# EAGLE design Bias_Lighting_Controller_Schematic (EAGLE 9.2.2)
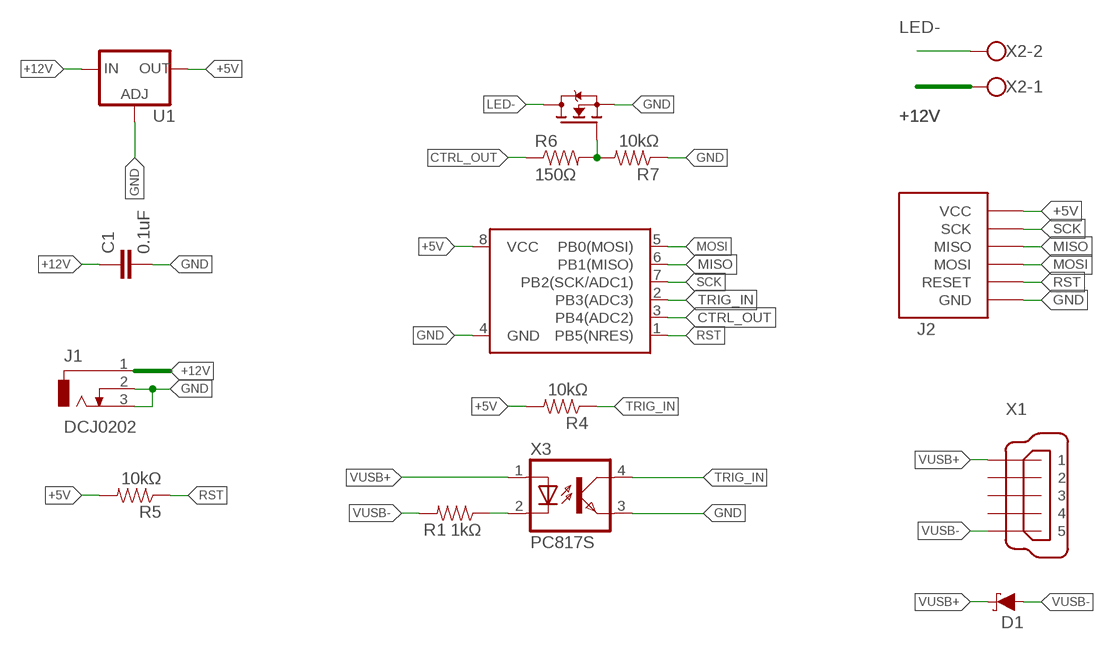
[diagram p0: schematic, sheet 1]

## Parts
ATTINY85  ATTINY45  [SO08-EIAJ]
C1  0.1uF  C-EUC1206K  [C1206K]
D1  DIODE-SCHOTTKY-SS14  [SMA-DIODE]
IRF740_MOSFET1  MOSFET-N-SOT23  [SOT23]
J1  DCJ0202  [DCJ0202]
J2  AVR_MICRO_ICP  [AVR_MICRO_ICP]
R1  1kΩ  RESISTOR1206  [1206]
R4  10kΩ  RESISTOR1206  [1206]
R5  10kΩ  RESISTOR1206  [1206]
R6  150Ω  RESISTOR1206  [1206]
R7  10kΩ  RESISTOR1206  [1206]
U1  V_REG_317SMD  [SOT223]
X1  MINI-USB-UX60-MB-5ST  [UX60-MB-5ST]
X2  W237-102  [W237-102]
X3  PC817S  [PC817SMT]

## Nets
+5V: ATTINY85.8(VCC) J2.VCC R4.2 R5.2 U1.2(OUT)
+12V: C1.1 J1.1 U1.3(IN) X2.1
CTRL_OUT: ATTINY85.3(PB4(ADC2)) R6.1
GND: ATTINY85.4(GND) C1.2 IRF740_MOSFET1.2(S) J1.2 J1.3 J2.GND R7.1 U1.1(ADJ) X3.3(EMIT)
LED-: IRF740_MOSFET1.3(D) X2.2
MISO: ATTINY85.6(PB1(MISO)) J2.MISO
MOSI: ATTINY85.5(PB0(MOSI)) J2.MOSI
N$6: IRF740_MOSFET1.1(G) R6.2 R7.2
RST: ATTINY85.1(PB5(NRES)) J2.RESET R5.1
SCK: ATTINY85.7(PB2(SCK/ADC1)) J2.SCK
TRIG-: R1.1 X3.2(C)
TRIG_IN: ATTINY85.2(PB3(ADC3)) R4.1 X3.4(COL)
VUSB+: D1.C X1.1 X3.1(A)
VUSB-: D1.A R1.2 X1.5
Unconnected: X1.2 X1.3 X1.4

## Library data of the parts
ATTINY85 = SparkFun-DigitalIC:ATTINY45: Atmel 8-pin 2/4/8kB flash uC
C1 = GDOv5 Board:C-EU: CAPACITOR, European symbol
D1 = SparkFun-DiscreteSemi:DIODE-SCHOTTKY: Schottky diode A Schottky diode is a semiconductor diode which has a low forward voltage drop and a very fast switching action.; PROD_ID: DIO-08053; VALUE: 1A/40V/500mV
IRF740_MOSFET1 = we-transistor:MOSFET-N: N-Channel MOSFET (e.g. IRLML2502, BSS138)
J1 = con-jack:DCJ0202: DC POWER JACK Source: DCJ0202.pdf; OC_FARNELL: unknown; OC_NEWARK: unknown
J2 = kanflo:AVR_MICRO_ICP: A tiny AVR ICP connector.
R1 R4-R7 = SparkFun-Resistors:RESISTOR: Resistor Basic schematic elements and footprints for 0603, 1206, and PTH resistors.
U1 = SparkFun-IC-Power:V_REG_317: Voltage Regulator Standard LM317 adjustable voltage regulator. AOI (Adjust Output Input). Google 'LM317 Calculator' for easy to use app to get the two resistor values needed. 240/720 for 5V output. 240/390 for 3.3V output. Spark Fun Electronics SKU : COM-00527
X1 = con-hirose:MINI-USB-: MINI USB Connector Source: http://www.hirose.co.jp/cataloge_hp/e24000019.pdf; OC_FARNELL: unknown; OC_NEWARK: unknown
X2 = con-wago-500:W237-102: WAGO SCREW CLAMP; MPN: 237-102; OC_FARNELL: unknown; OC_NEWARK: 70K9898
X3 = GadgetFactory_v1:PC817

## Board
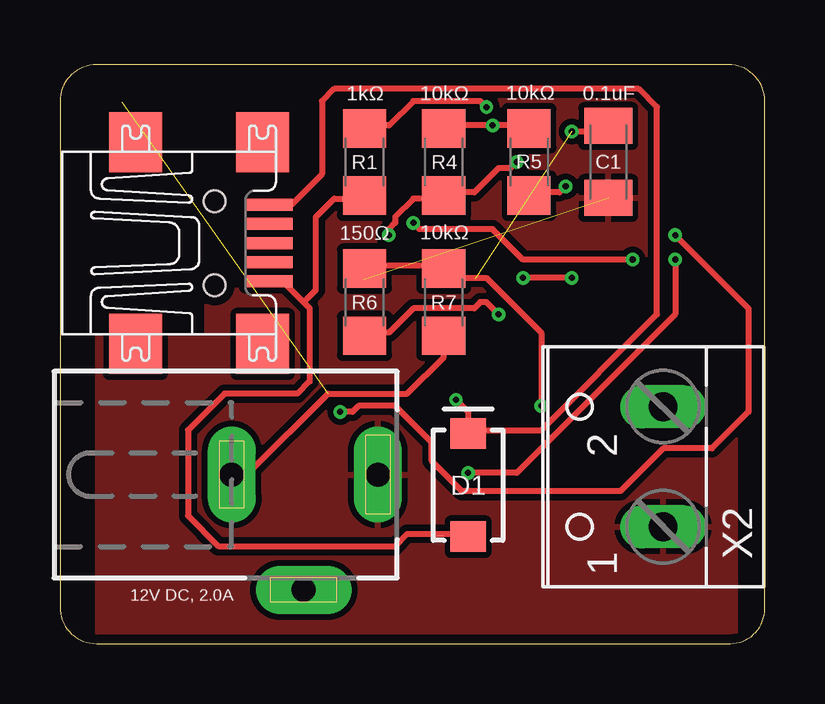
[diagram p1: board, top side]
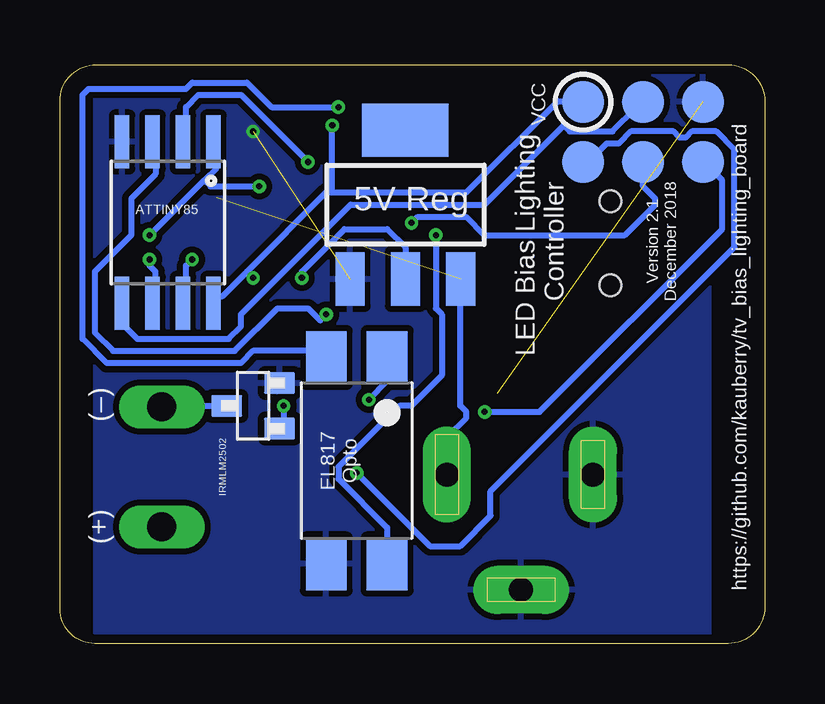
[diagram p2: board, bottom side, seen from below]

Size 29.39 x 24.12 mm. Coordinates in mm from the lower left corner, seen from the top.
Outline: 1.52,0 27.94,0 arc90 29.39,1.45 29.39,22.61 arc90 27.87,24.12 1.52,24.12 arc90 0,22.6 0,1.52 arc90 1.52,0
Copper layers (1*16): Top 0.035559375mm / dielectric 1.6mm / Bottom 0.035559375mm
Design rules "oshpark-2layer-auto-routing": minimum track width 10mil, minimum drill 10mil, track to track 10mil, track to pad 8mil, pad to pad 8mil, via to via 8mil, smd to smd 6mil, copper to edge 15mil, drill to drill 6mil, minimum pad ring 6mil, minimum via ring 6mil, stop-mask expansion 2.5mil, vias tented up to drill 0mil, thermal gap 10mil

### Footprints (pad centres in the part's own frame; a part is rotated, then mirrored left to right if it is on the bottom)
SO08-EIAJ = smd 0.61 x 2.21: 1 -1.905,-3.378; 2 -0.635,-3.378; 3 0.635,-3.378; 4 1.905,-3.378; 5 1.905,3.353; 6 0.635,3.353; 7 -0.635,3.353; 8 -1.905,3.353
C1206K = smd 1.5 x 2: 1 -1.5,0; 2 1.5,0
SMA-DIODE = smd 1.27 x 1.47: A -2.15,0; C 2.15,0
SOT23 = smd 1.3 x 0.9: 1 -1.1,0.95; 2 -1.1,-0.95; 3 1.1,0
DCJ0202 = drill 1 pad 2 long: 1 0,3.1; 2 4.8,0; 3 0,-3
AVR_MICRO_ICP = smd 1.75 x 1.75: GND 2.5,-2.5; MISO 0,2.5; MOSI 2.5,0; RESET 0,-2.5; SCK 0,0; VCC 2.5,2.5
1206 = smd 1.6 x 1.8: 1 -1.4,0; 2 1.4,0
SOT223 = smd 1.219 x 2.235: 1 -2.311,-3.099; 2 0,-3.099; 3 2.311,-3.099 | smd 3.6 x 2.2: 4 0,3.099
UX60-MB-5ST = smd 2 x 0.5: 1 2.25,1.6; 2 2.25,0.8; 3 2.25,0; 4 2.25,-0.8; 5 2.25,-1.6 | smd 2.2 x 2.5: M1 -3.3,-4.2; M2 -3.3,4.2; M3 2,4.2; M4 2,-4.2 | hole 0.9: 0,-1.75; 0,1.75
W237-102 = drill 1.194 long: 1 -2.5,-1.27; 2 2.5,-1.27
PC817SMT = smd 1.7 x 2.2: 1 -1.27,-4.3; 2 1.27,-4.3; 3 1.27,4.3; 4 -1.27,4.3

### Placement (x,y rotation side)
ATTINY85  24.89,17.53 180 bottom
C1  22.86,20.07 90 top
D1  17.02,6.6 90 top
IRF740_MOSFET1  21.34,9.91 180 bottom
J1  10.16,7.04 270 top
J2  5.08,20.07 90 bottom
R1  12.7,20.07 270 top
R4  16,20.07 90 top
R5  19.56,20.07 90 top
R6  12.7,14.22 90 top
R7  16,14.22 90 top
U1  14.99,18.29 0 bottom
X1  6.45,16.69 0 top
X2  23.88,7.37 90 top
X3  17.02,7.62 180 bottom

### Tracks (layer width: path | path; a pad name or v marks a point on that pad's centre or on a via)
+5V  (via drill 0.25)
  Top 0.254: R4.2 16,21.59 v18.03,21.59 19.56,21.59 R5.2 | v21.34,15.24 v19.3,15.24
  Bottom 0.254: 18.03,18.8 18.29,18.8 21.59,15.49 | 18.03,18.8 12.45,18.8 8.64,22.61 7.62,22.61 J2.VCC | 21.59,15.49 22.61,14.48 22.86,14.48 23.11,14.22 ATTINY85.8 | U1.2 14.99,16.51 15.75,17.27 17.53,17.27 19.3,15.49 v19.3,15.24 | 21.59,15.49 v21.34,15.24 | 18.03,18.8 v18.03,21.59
+12V  (1 unrouted)
  Bottom 0.254: U1.3 12.7,14.99 12.7,9.91 12.45,9.65 12.45,9.4 13.21,8.64 13.21,7.11 J1.1
  pour Top: 1.52,23.88 1.52,0.25 28.19,0.25 28.19,23.88
CTRL_OUT  (via drill 0.25)
  Top 0.254: v18.29,13.72 17.78,14.22 17.53,14.22 17.27,13.97 14.73,13.97 13.72,12.95 12.7,12.95 R6.1
  Bottom 0.254: v18.29,13.72 18.54,13.46 19.05,13.97 20.32,13.97 22.1,12.19 27.18,12.19 27.94,12.95 27.94,15.49 26.42,17.02 26.42,18.54 25.4,19.56 25.4,20.83 ATTINY85.3
GND  (via drill 0.25)  (2 unrouted)
  Top 0.254: R7.1 16,11.94 14.48,10.41 11.18,10.41 7.87,7.11 7.37,7.11 J1.3 | v21.34,21.34 22.86,21.34 C1.2
  pour Bottom: 2.29,23.62 2.29,0.25 27.94,0.25 27.94,24.13 2.79,24.13
LED-
  Bottom 0.254: IRF740_MOSFET1.3 25.15,9.91 X2.2
MISO  (via drill 0.25)
  Top 0.254: v17.02,7.11 19.05,7.11 25.65,13.72 v25.65,16
  Bottom 0.254: v17.02,7.11 13.97,4.06 12.7,4.06 11.43,5.33 11.43,6.35 1.27,16.51 1.27,20.57 2.03,21.34 3.05,21.34 3.3,21.08 3.56,21.08 3.81,21.34 5.59,21.34 6.1,20.83 6.6,20.83 7.37,20.07 J2.MISO | v25.65,16 25.65,15.75 25.4,15.49 25.4,14.22 ATTINY85.6
MOSI
  Bottom 0.254: J2.MOSI 5.08,22.35 5.33,22.35 6.35,21.34 8.13,21.34 8.38,21.59 11.68,18.29 17.27,18.29 21.84,13.72 21.84,13.21 22.35,12.7 26.16,12.7 26.67,13.21 26.67,13.97 ATTINY85.5
N$6  (via drill 0.25)
  Top 0.254: v20.07,9.91 20.07,12.95 17.78,15.24 16.26,15.24 16,15.49 R7.2 16,15.75 12.7,15.75 R6.2
  Bottom 0.254: v20.07,9.91 20.07,9.14 IRF740_MOSFET1.1
RST  (via drill 0.25)
  Top 0.254: v11.68,9.65 12.19,9.65 12.45,9.91 13.97,9.91 15.49,8.38 15.49,7.62 16.76,6.35 23.37,6.35 25.15,8.13 27.18,8.13 28.7,9.65 28.7,13.97 v25.65,17.02 | v21.08,19.05 20.83,18.8 19.56,18.8 R5.1
  Bottom 0.254: v11.68,9.65 9.4,9.65 1.78,17.27 1.78,19.3 2.54,20.07 J2.RESET | 23.37,19.3 22.86,19.81 22.86,20.83 ATTINY85.1 | 23.37,19.3 v25.65,17.02 | v21.08,19.05 23.11,19.05 23.37,19.3
SCK  (via drill 0.25)
  Top 0.254: v14.73,17.53 14.99,17.27 18.03,17.27 19.3,16 v23.88,16
  Bottom 0.254: J2.SCK 5.08,19.05 4.57,18.54 4.57,18.29 5.84,17.02 11.68,17.02 12.45,17.78 14.48,17.78 v14.73,17.53 | v23.88,16 24.13,15.75 24.13,14.22 ATTINY85.7
TRIG-  (via drill 0.25)
  Top 0.254: v17.78,22.35 17.53,22.61 14.73,22.61 13.72,21.59 12.7,21.59 R1.1
  Bottom 0.254: v17.78,22.35 20.57,22.35 21.59,23.37 23.88,23.37 24.13,23.11 28.19,23.11 28.45,22.86 28.45,12.7 27.43,11.68 21.84,11.68 21.34,12.19 18.54,12.19 18.29,11.94 X3.2
TRIG_IN  (via drill 0.25)
  Top 0.254: v19.05,20.07 18.8,19.81 18.29,19.81 17.27,18.8 16,18.8 R4.1 16,18.54 14.73,18.54 13.97,17.78 13.97,17.53 13.72,17.27 v13.72,17.02
  Bottom 0.254: v19.05,20.07 21.84,22.86 23.62,22.86 24.13,22.35 24.13,21.08 ATTINY85.2 | X3.4 15.75,4.83 17.78,6.86 17.78,7.37 15.24,9.91 14.73,9.91 13.46,11.18 13.46,13.72 13.72,13.97 v13.72,17.02
VUSB+  (via drill 0.25)
  Top 0.254: 17.02,8.89 17.02,9.65 v16.51,10.16 | 17.02,8.89 20.07,8.89 24.89,13.72 24.89,22.35 24.13,23.11 11.43,23.11 10.92,22.61 10.92,19.56 9.65,18.29 8.89,18.29 X1.1 | 17.02,8.89 D1.C
  Bottom 0.254: v16.51,10.16 15.75,10.92 X3.1
VUSB-
  Top 0.254: 10.16,14.22 9.14,15.24 8.89,15.24 X1.5 | 10.16,14.22 10.41,13.97 10.41,10.92 9.91,10.41 6.86,10.41 5.33,8.89 5.33,5.33 6.6,4.06 13.97,4.06 14.48,4.57 17.02,4.57 D1.A | 10.16,14.22 10.67,14.73 10.67,17.78 11.43,18.54 12.7,18.54 R1.2

### Text on the board
tNames: 12V DC, 2.0A
bNames: VCC | 5V Reg | Version 2.1 / December 2018 | LED Bias Lighting / Controller | https://github.com/kauberry/tv_bias_lighting_board | (–) | EL817 / Opto | IRMLM2502 | (+)